# EAGLE design central-perfboard (EAGLE 9.6.2)
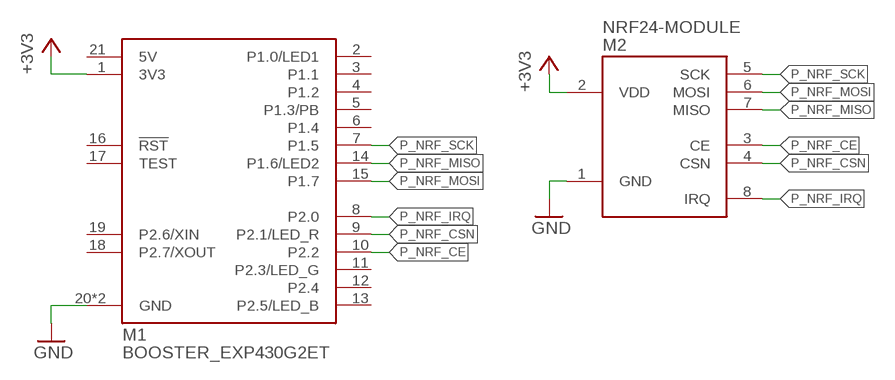
[diagram p0: schematic, sheet 1]

## Parts
M1  BOOSTER_EXP430G2ET  [BOOSTER_PACK]
M2  NRF24-MODULE  [NRF24-MODULE]

## Nets
+3V3: M1.1(3V3) M2.2(VDD)
GND: M1.20(GND) M1.22(GND) M2.1(GND)
P_NRF_CE: M1.10(P2.2) M2.3(CE)
P_NRF_CSN: M1.9(P2.1/LED_R) M2.4(CSN)
P_NRF_IRQ: M1.8(P2.0) M2.8(IRQ)
P_NRF_MISO: M1.14(P1.6/LED2) M2.7(MISO)
P_NRF_MOSI: M1.15(P1.7) M2.6(MOSI)
P_NRF_SCK: M1.7(P1.5) M2.5(SCK)
Unconnected: M1.2(P1.0/LED1) M1.3(P1.1) M1.4(P1.2) M1.5(P1.3/PB) M1.6(P1.4) M1.11(P2.3/LED_G) M1.12(P2.4) M1.13(P2.5/LED_B) M1.16(!RST!) M1.17(TEST) M1.18(P2.7/XOUT) M1.19(P2.6/XIN) M1.21(5V)

## Library data of the parts
M1 = rfr-lib-misc:BOOSTER_EXP430G2ET
M2 = msp430-nrf-wsn-lib:NRF24-MODULE

## Board
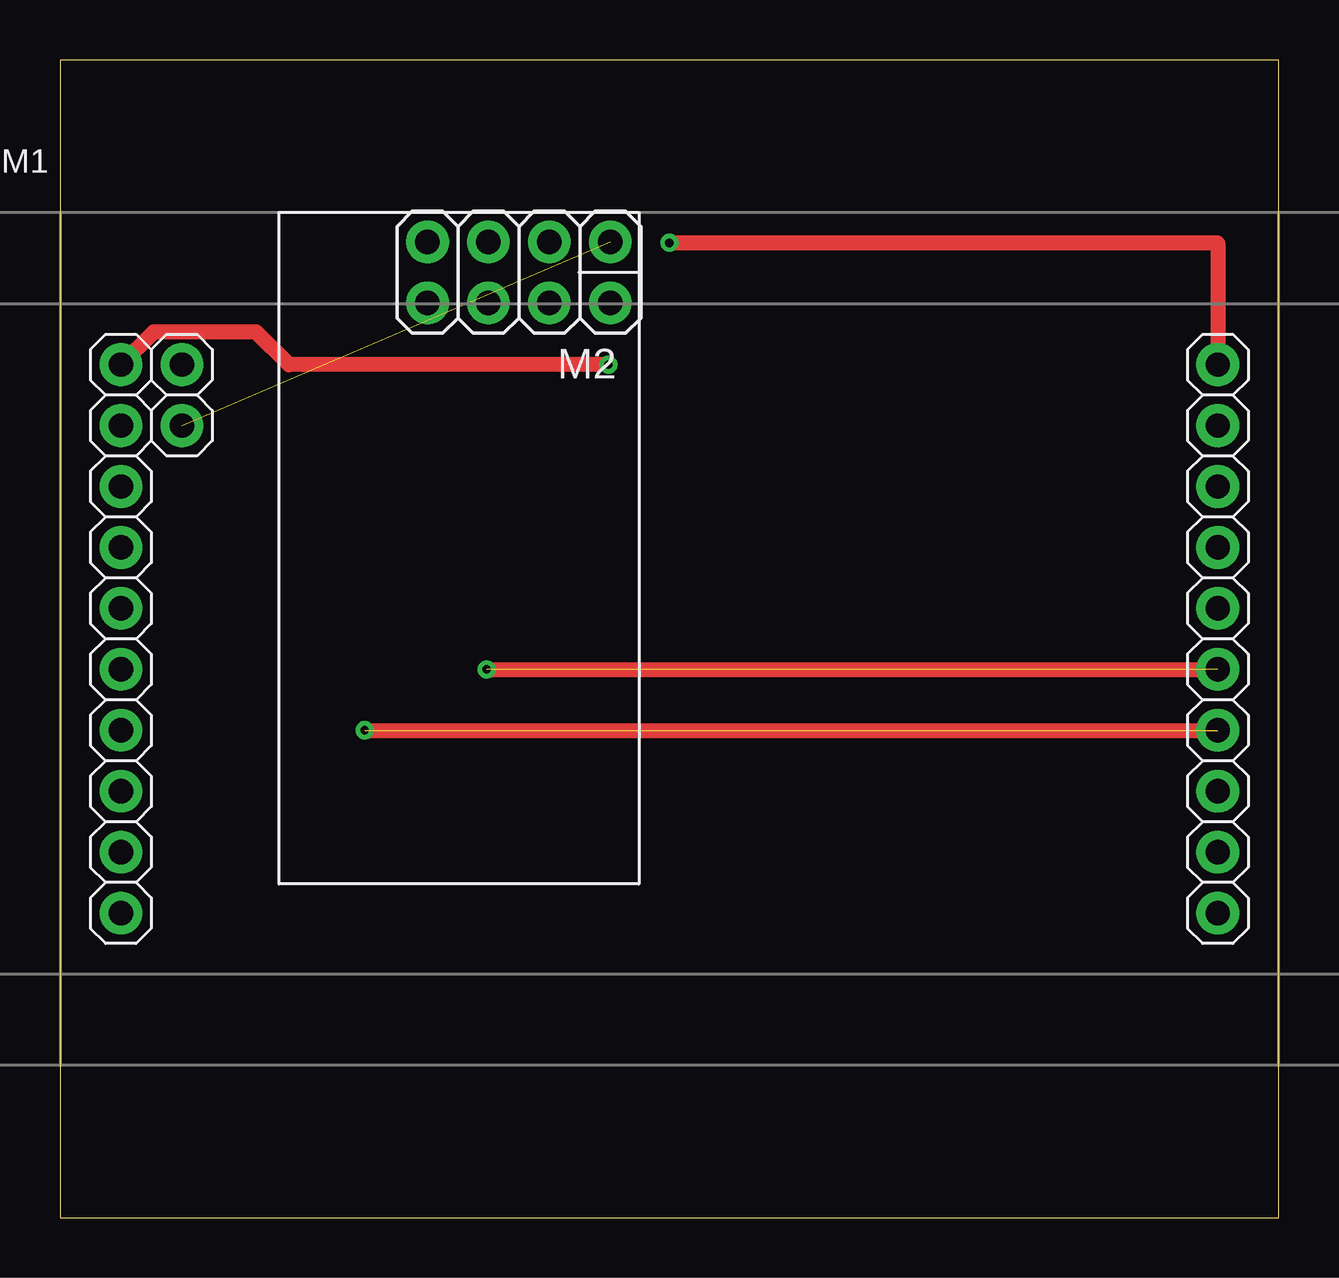
[diagram p1: board, top side]
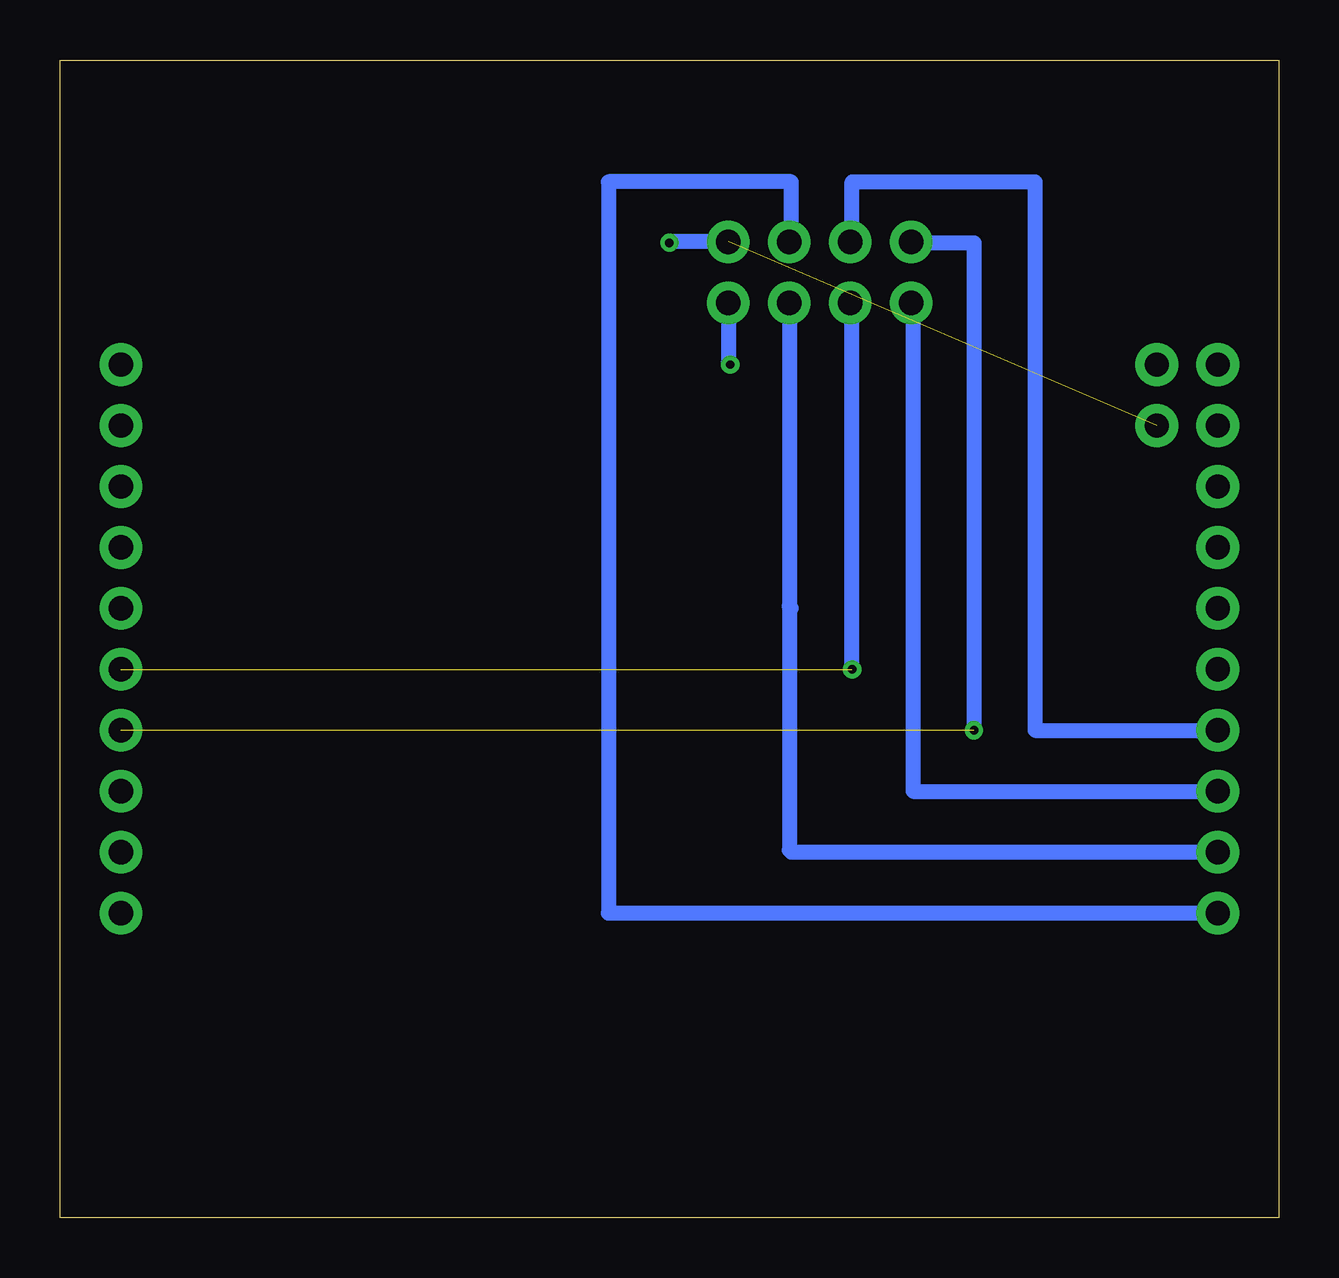
[diagram p2: board, bottom side, seen from below]

Size 50.8 x 48.26 mm. Coordinates in mm from the lower left corner, seen from the top.
Outline: 0,0 50.8,0 50.8,48.26 0,48.26 0,0
Copper layers (1*16): Top 0.035mm / dielectric 1.5mm / Bottom 0.035mm
Design rules "default": minimum track width 6mil, minimum drill 0.35mm, track to track 6mil, track to pad 6mil, pad to pad 6mil, via to via 6mil, smd to smd 6mil, copper to edge 40mil, drill to drill 6mil, minimum pad ring 10mil, minimum via ring 8mil, stop-mask expansion 4mil, vias tented up to drill 0mil, thermal gap 10mil

### Footprints (pad centres in the part's own frame; a part is rotated, then mirrored left to right if it is on the bottom)
BOOSTER_PACK = drill 1.016 pad 1.778: 1 0,0; 2 0,-2.54; 3 0,-5.08; 4 0,-7.62; 5 0,-10.16; 6 0,-12.7; 7 0,-15.24; 8 0,-17.78; 9 0,-20.32; 10 0,-22.86; 11 45.72,-22.86; 12 45.72,-20.32; 13 45.72,-17.78; 14 45.72,-15.24; 15 45.72,-12.7; 16 45.72,-10.16; 17 45.72,-7.62; 18 45.72,-5.08; 19 45.72,-2.54; 20 45.72,0; 21 2.54,0; 22 2.54,-2.54
NRF24-MODULE = drill 1.016 pad 1.778: 1 1.19,1.23; 2 1.19,3.77; 3 3.73,1.23; 4 3.73,3.77; 5 6.27,1.23; 6 6.27,3.77; 7 8.81,1.23; 8 8.81,3.77

### Placement (x,y rotation side)
M1  2.54,35.56 0 top
M2  24.13,41.91 180 top

### Tracks (layer width: path | path; a pad name or v marks a point on that pad's centre or on a via)
+3V3  (via drill 0.35)
  Top 0.635: v22.86,35.56 9.54,35.56 8.18,36.92 3.9,36.92 M1.1
  Bottom 0.635: M2.2 22.94,35.64 v22.86,35.56
GND  (via drill 0.35)  (1 unrouted)
  Top 0.635: M1.20 48.26,40.64 v25.4,40.64
  Bottom 0.635: M2.1 25.36,40.68 v25.4,40.64
P_NRF_CE
  Bottom 0.635: M2.3 20.32,40.76 20.32,43.18 27.94,43.18 27.94,12.7 M1.10
P_NRF_CSN
  Bottom 0.635: M2.4 20.4,25.48 | 20.4,25.48 20.32,25.4 | 20.4,25.48 20.4,15.32 20.32,15.24 M1.9
P_NRF_IRQ
  Bottom 0.635: M2.8 15.24,38.06 15.24,17.78 M1.8
P_NRF_MISO  (via drill 0.35)  (1 unrouted)
  Top 0.635: v12.7,20.32 M1.14
  Bottom 0.635: M2.7 15.28,40.64 12.7,40.64 v12.7,20.32
P_NRF_MOSI  (via drill 0.35)  (1 unrouted)
  Top 0.635: v17.78,22.86 M1.15
  Bottom 0.635: v17.78,22.86 17.78,38.06 M2.6
P_NRF_SCK
  Bottom 0.635: M2.5 17.78,40.76 17.78,43.18 10.16,43.18 10.16,20.32 M1.7